# EasyEDA schematic SCH_microprocessor-8085_2025-05-18.json
TITLE: 8085 microprocessor; REV: 1.0; Date: 2025-05-18; Sheet: 1/1; Drawn By: Sufyan Nadeem; Company: Your Company
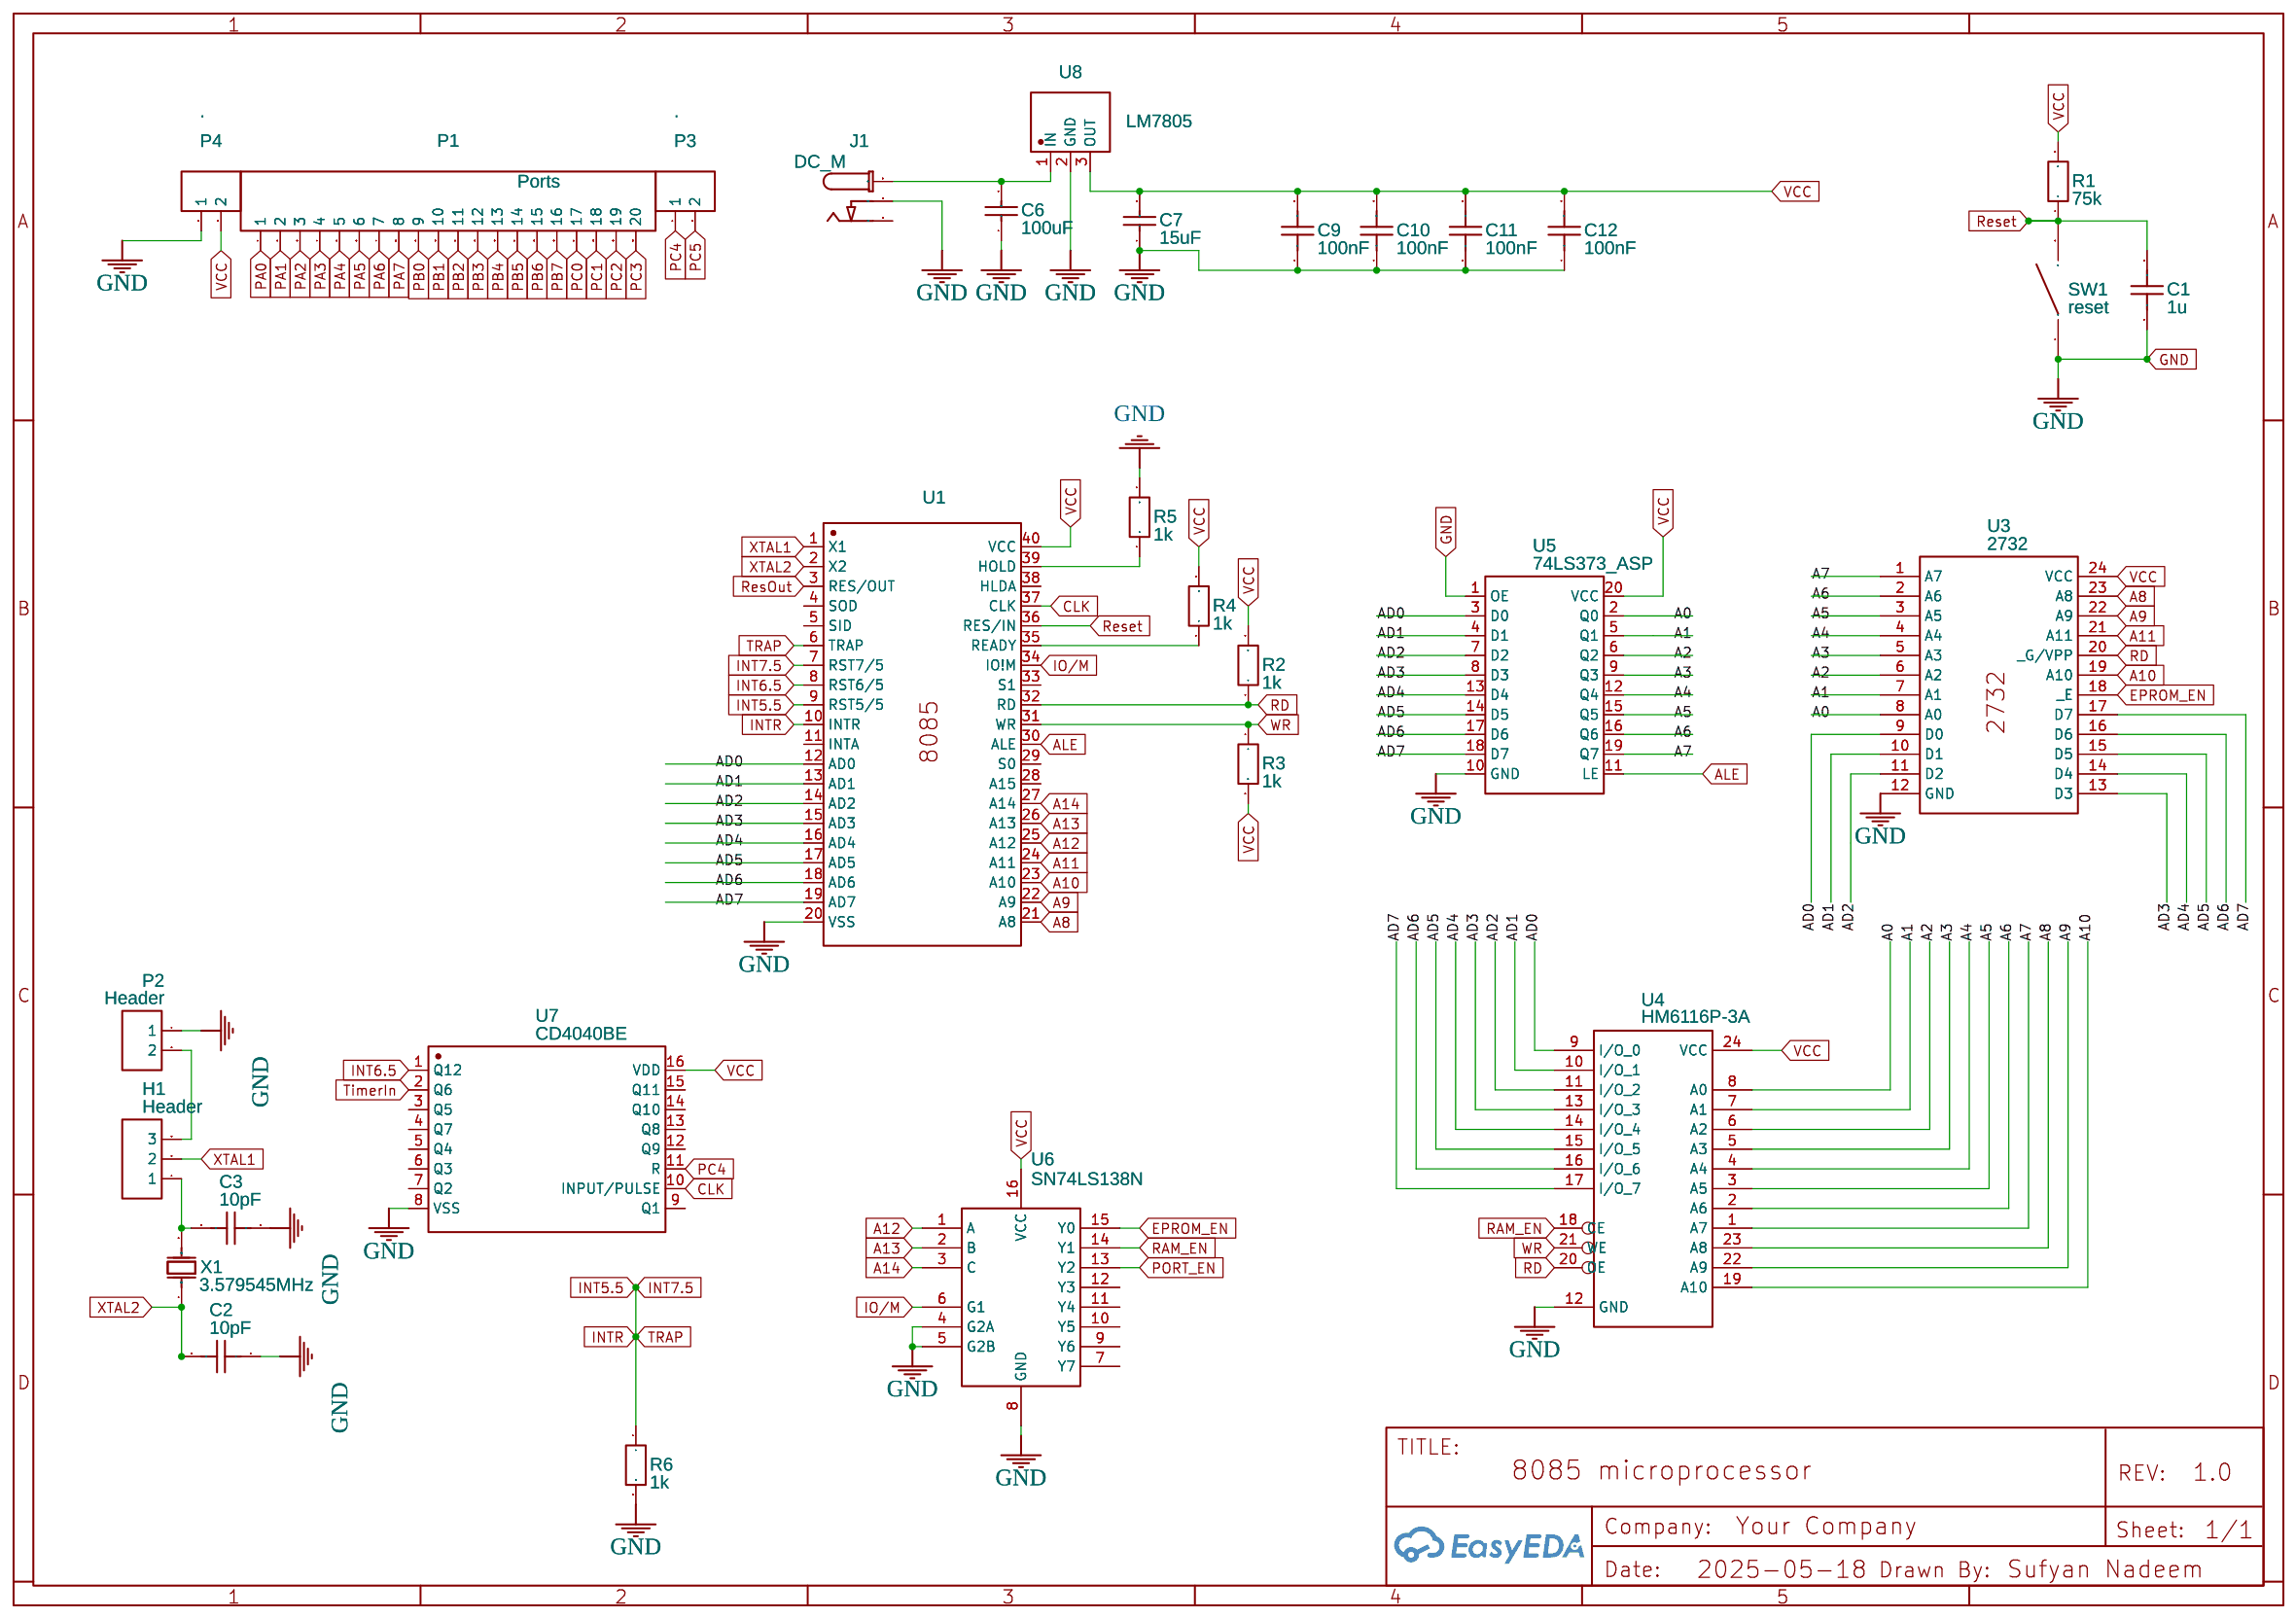
[diagram p0: schematic sheet]

## Parts
C1  1u  [RAD-0.1]
C2  10pF  [CAP-TH_L4.2-W3.8-P5.08-D0.5]
C3  10pF  [CAP-TH_L4.2-W3.8-P5.08-D0.5]
C6  100uF  [CAP-CBB-6.5*4.0]
C7  15uF  [CAP-CBB-6.5*4.0]
C9  100nF  [CAP-0.2]
C10  100nF  [CAP-0.2]
C11  100nF  [CAP-0.2]
C12  100nF  [CAP-0.2]
H1  Header  [HDR-TH_3P-P2.54-V]
J1  DC_M  [DC_BARREL_JACK_PTH_2MM_2]
P1  Ports  [HDR-20X1/2.54]
P2  Header  [HDR-TH_2P-P2.54-V-M]
P3  .  [HDR-1X2/2.54]
P4  .  [HDR-1X2/2.54]
R1  75k  [AXIAL-0.3]
R2  1k  [AXIAL-0.3]
R3  1k  [AXIAL-0.3]
R4  1k  [AXIAL-0.3]
R5  1k  [AXIAL-0.3]
R6  1k  [AXIAL-0.3]
SW1  reset  [KEY-6.0*6.0-4]
U1  8085_ASP  [DIP-40_L52.3-W13.9-P2.54-LS15.2-BL]
U3  2732  [2732]
U4  HM6116P-3A  [DIP24-600]
U5  74LS373_ASP  [DIP-20_L25.5-W10.0-P2.54-LS7.6-BL]
U6  SN74LS138N  [DIP-16_300MIL]
U7  CD4040BE  [DIP-16_16P-L20.2-W6.6-P2.54-LS7.6-BL]
U8  LM7805  [TO-220-3_L10.0-W4.5-P2.54-L]
X1  3.579545MHz  [HC-49US_L11.5-W4.5-P4.88]

## Library data of the parts
C1 = Cap_RAD-0.1_US
C2 C3 = CC4-0805N100 J500: Supplier: LCSC; Manufacturer: ReliaPro; Supplier Part: C3779
C6 C7 = CAPACITOR15NF100V: Supplier: LCSC; Manufacturer: ReliaPro; Manufacturer Part: Capacitor15nf100v; Contributor: LCSC; Supplier Part: C26191
C9-C12 = CT4-0805B104K500F3: Supplier: LCSC; Manufacturer: FH; Contributor: LCSC; Supplier Part: C84772
H1 = -: Supplier: LCSC; Manufacturer: BOOMELE; Manufacturer Part: Header2.54mm 1*3P; image: //image.lceda.cn/szlcsc/C49257.jpg; Supplier Part: C49257
J1 = -: Contributor: DangerousPrototype
P1 = -: Supplier: LCSC; Manufacturer: BOOMELE; Manufacturer Part: 2.54mm 1*20P Female header; Supplier Part: C50984
P2 = Header-Female-2.54_1x2: Supplier: LCSC; Manufacturer: BOOMELE; Manufacturer Part: 2.54-1*2PFemale; image: //image.lceda.cn/szlcsc/C49661.jpg; Supplier Part: C49661
P3 P4 = -: Supplier: LCSC; Manufacturer: BOOMELE; Manufacturer Part: 2.54-1*2PFemale; image: //image.lceda.cn/szlcsc/C49661.jpg; Supplier Part: C49661
R1-R6 = Res_AXIAL-0.3(1/8W)_EU
SW1 = -: Supplier: LCSC; Manufacturer: PANASONIC; Manufacturer Part: EVQ22705R; Contributor: LCSC; Supplier Part: C79156
U1 U3 U5 = -: Contributor: spiessa
U4 = HM6116P-3A: Manufacturer Part: HM6116P-3; link: http://pdf1.alldatasheet.com/datasheet-pdf/view/77364/HITACHI/HM6116P-3.html; Contributor: tm1171
U6 = -: Supplier: LCSC; Supplier Part: C352964; Manufacturer: Texas Instruments; Contributor: LCSC
U7 = -: Supplier: LCSC; Manufacturer: TI; Supplier Part: C73220
U8 = -: Supplier: LCSC; Supplier Part: C427632; Manufacturer: Unisonic Tech; Manufacturer Part: LM7805AL-TA3-T; Contributor: LCSC
X1 = XIHCELNANF-3.579545M: Supplier: LCSC; Supplier Part: C117861; Manufacturer: TAITIEN Elec; Contributor: LCSC

## Nets
GND: C1.1 C2.1 C3.1 C6.1 C7.1 C9.1 C10.1 C11.1 C12.1 J1.P2(P3) P2.1 P4.1 R5.2 R6.2 SW1.1 U1.20(VSS) U3.12(GND) U4.12(GND) U5.1(OE) U5.10(GND) U6.4(G2A) U6.5(G2B) U6.8(GND) U7.8(VSS) U8.2(GND)
VCC: C7.2 C9.2 C10.2 C11.2 C12.2 P4.2 R1.2 R2.2 R3.2 R4.2 U1.40(VCC) U3.24(VCC) U4.24(VCC) U5.20(VCC) U6.16(VCC) U7.16(VDD) U8.3(OUT)
A0: U3.8(A0) U4.8(A0) U5.2(Q0)
A1: U3.7(A1) U4.7(A1) U5.5(Q1)
A2: U3.6(A2) U4.6(A2) U5.6(Q2)
A3: U3.5(A3) U4.5(A3) U5.9(Q3)
A4: U3.4(A4) U4.4(A4) U5.12(Q4)
A5: U3.3(A5) U4.3(A5) U5.15(Q5)
A6: U3.2(A6) U4.2(A6) U5.16(Q6)
A7: U3.1(A7) U4.1(A7) U5.19(Q7)
A8: U1.21(A8) U3.23(A8) U4.23(A8)
A9: U1.22(A9) U3.22(A9) U4.22(A9)
A10: U1.23(A10) U3.19(A10) U4.19(A10)
A11: U1.24(A11) U3.21(A11)
A12: U1.25(A12) U6.1(A)
A13: U1.26(A13) U6.2(B)
A14: U1.27(A14) U6.3(C)
AD0: U1.12(AD0) U3.9(D0) U4.9(I/O 0) U5.3(D0)
AD1: U1.13(AD1) U3.10(D1) U4.10(I/O 1) U5.4(D1)
AD2: U1.14(AD2) U3.11(D2) U4.11(I/O 2) U5.7(D2)
AD3: U1.15(AD3) U3.13(D3) U4.13(I/O 3) U5.8(D3)
AD4: U1.16(AD4) U3.14(D4) U4.14(I/O 4) U5.13(D4)
AD5: U1.17(AD5) U3.15(D5) U4.15(I/O 5) U5.14(D5)
AD6: U1.18(AD6) U3.16(D6) U4.16(I/O 6) U5.17(D6)
AD7: U1.19(AD7) U3.17(D7) U4.17(I/O 7) U5.18(D7)
ALE: U1.30(ALE) U5.11(LE)
CLK: U1.37(CLK) U7.10(INPUT/PULSE)
EPROM_EN: U3.18(_E) U6.15(Y0)
INT5.5: R6.1 U1.6(TRAP) U1.7(RST7/5) U1.9(RST5/5) U1.10(INTR)
INT6.5: U1.8(RST6/5) U7.1(Q12)
IO/M: U1.34(IO!M) U6.6(G1)
PA0: P1.1
PA1: P1.2
PA2: P1.3
PA3: P1.4
PA4: P1.5
PA5: P1.6
PA6: P1.7
PA7: P1.8
PB0: P1.9
PB1: P1.10
PB2: P1.11
PB3: P1.12
PB4: P1.13
PB5: P1.14
PB6: P1.15
PB7: P1.16
PC0: P1.17
PC1: P1.18
PC2: P1.19
PC3: P1.20
PC4: P3.1 U7.11(R)
PC5: P3.2
PORT_EN: U6.13(Y2)
RAM_EN: U4.18(CE) U6.14(Y1)
RD: R2.1 U1.32(RD) U3.20(_G/VPP) U4.20(OE)
Reset: C1.2 R1.1 SW1.2 U1.36(RES/IN)
ResOut: U1.3(RES/OUT)
TimerIn: U7.2(Q6)
WR: R3.1 U1.31(WR) U4.21(WE)
XTAL1: H1.2 U1.1(X1)
XTAL2: C2.2 U1.2(X2) X1.1(OSC1)
Net-(C3-2): C3.2 H1.1 X1.2(OSC2)
Net-(C6-2): C6.2 J1.P1 U8.1(IN)
Net-(H1-3): H1.3 P2.2
Net-(R4-1): R4.1 U1.35(READY)
Net-(R5-1): R5.1 U1.39(HOLD)

Not connected (* = marked no-connect by the designer): J1 P3(P2); U1 4(SOD) 5(SID) 11(INTA) 28(A15) 29(S0) 33(S1) 38(HLDA); U6 7(Y7) 9(Y6) 10(Y5) 11(Y4) 12(Y3); U7 3(Q5) 4(Q7) 5(Q4) 6(Q3) 7(Q2) 9(Q1) 12(Q9) 13(Q8) 14(Q10) 15(Q11)
